# Altium schematic sheet 03_constant_temp.SchDoc
size A4
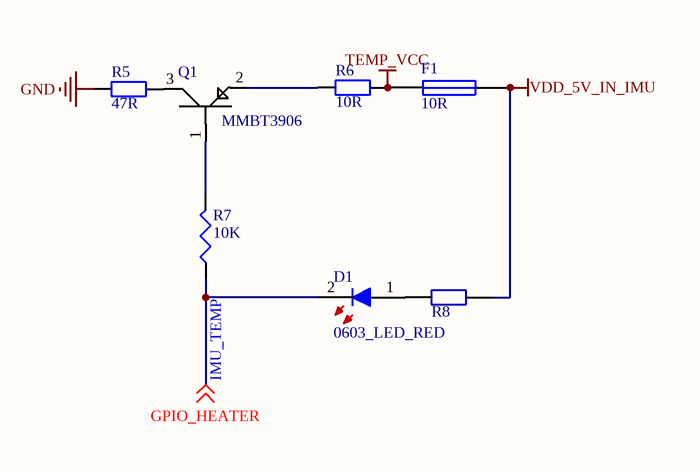
[diagram p0: 03_constant_temp.SchDoc]

## Parts
D1  0603_LED_RED  [0603-LED-RED]
F1  10R  [0805L]
Q1  MMBT3906  [SOT-23]
R5  47R  [1206F]
R6  10R  [1206F]
R7  10K  [0402r]
R8  2K  [0402R]  (value not drawn)

## Nets
GND: R5.1
TEMP_VCC: F1.1 R6.2
VDD_5V_IN_IMU: F1.2 R8.1
IMU_TEMP: D1.2 R7.1 ; off-sheet GPIO_HEATER  [also labelled GPIO_HEATER]
NetD1_1: D1.1 R8.2
NetQ1_1: Q1.1(base) R7.2
NetQ1_2: Q1.2(emitter) R6.1
NetQ1_3: Q1.3(collector) R5.2

## Library data of the parts
F1 = Fuse 1: Fuse; Published: 8-Jun-2000; LatestRevisionDate: 17-Jul-2002; LatestRevisionNote: Re-released for DXP Platform.; PackageReference: PIN-W2/E2.8; Publisher: Altium Limited; PackageDescription: Thru-Hole; 2 Leads
R5 R6 = Res2: Resistor; Value: 1K; Published: 8-Jun-2000; LatestRevisionDate: 17-Jul-2002; LatestRevisionNote: Re-released for DXP Platform.; PackageReference: AXIAL-0.4; Publisher: Altium Limited; PackageDescription: Axial Device, Thru-Hole; 2 Leads; 0.4 in Pin Spacing
R7 = RMCF0402FT4K99: RES TF 4.99K OHM 1% 1/16W 0402; Manufacturer: Stackpole Electronics Inc; Power (Watts): 0.063W, 1/16W; Tolerance: ?%; Value: 4k99; .Checked PCB: used; Temperature Coefficient: ?00ppm/癈; Category: Resistors; Supplier Part Number: RMCF0402FT4K99CT-ND; Manufacturer Part Number: RMCF0402FT4K99; Package / Case: 0402 (1005 Metric); Price 1k [$]: 0.00384; Resistance (Ohms): 4.99K; .Checked SCH: used; Supplier: Digikey; Supplier 1: Digi-Key; Supplier Part Number 1: RMCF0402FT4K99CT-ND; RoHS: RoHS Compliant; Stock 1: 48509; Pricing 1: 1=0.04, 10=0.025, 50=0.0138, 100=0.0105, 250=0.0078, 500=0.00576, 1000=0.00384 (USD); Composition: Thick Film; Features: -; Size / Dimension: 0.039" L x 0.020" W (1.00mm x 0.50mm); Height: 0.016" (0.40mm); Number of Terminations: 2; Packaging: Cut Tape (CT); ComponentLink1URL: http://www.seielect.com/Catalog/SEI-RMCF.pdf; ComponentLink1Description: http://www.seielect.com/Catalog/SEI-RMCF.pdf
R8 = 0402R100R: 0402R100R 1%